# Altium schematic sheet BPF.SchDoc: BPF
size A2 portrait; DocumentNumber: 13; Revision: 2.0; SheetNumber: 13; SheetTotal: 18; DocumentName: Лист 1.SCHDOC
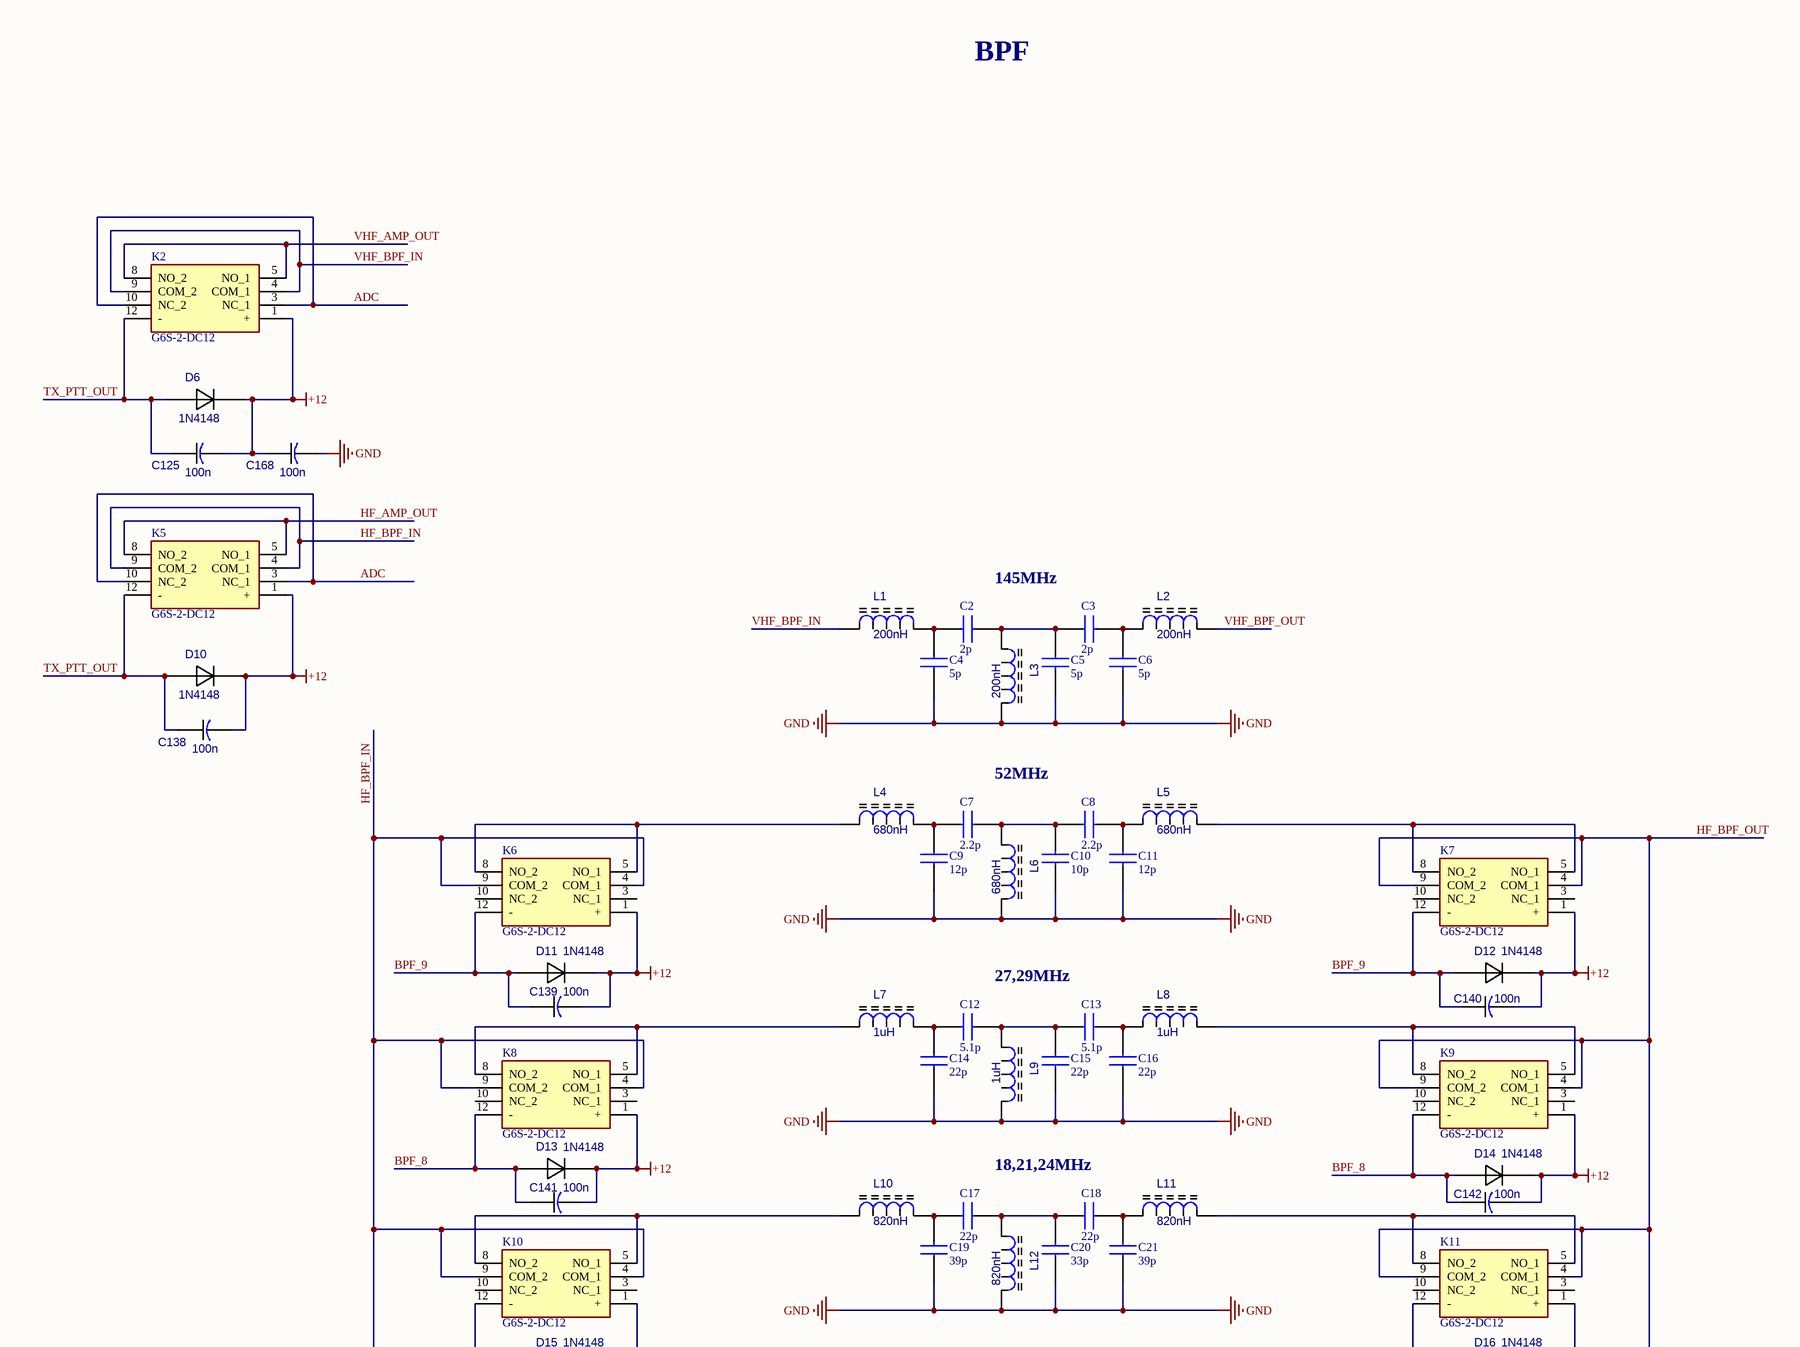
[diagram p0: BPF.SchDoc, top]
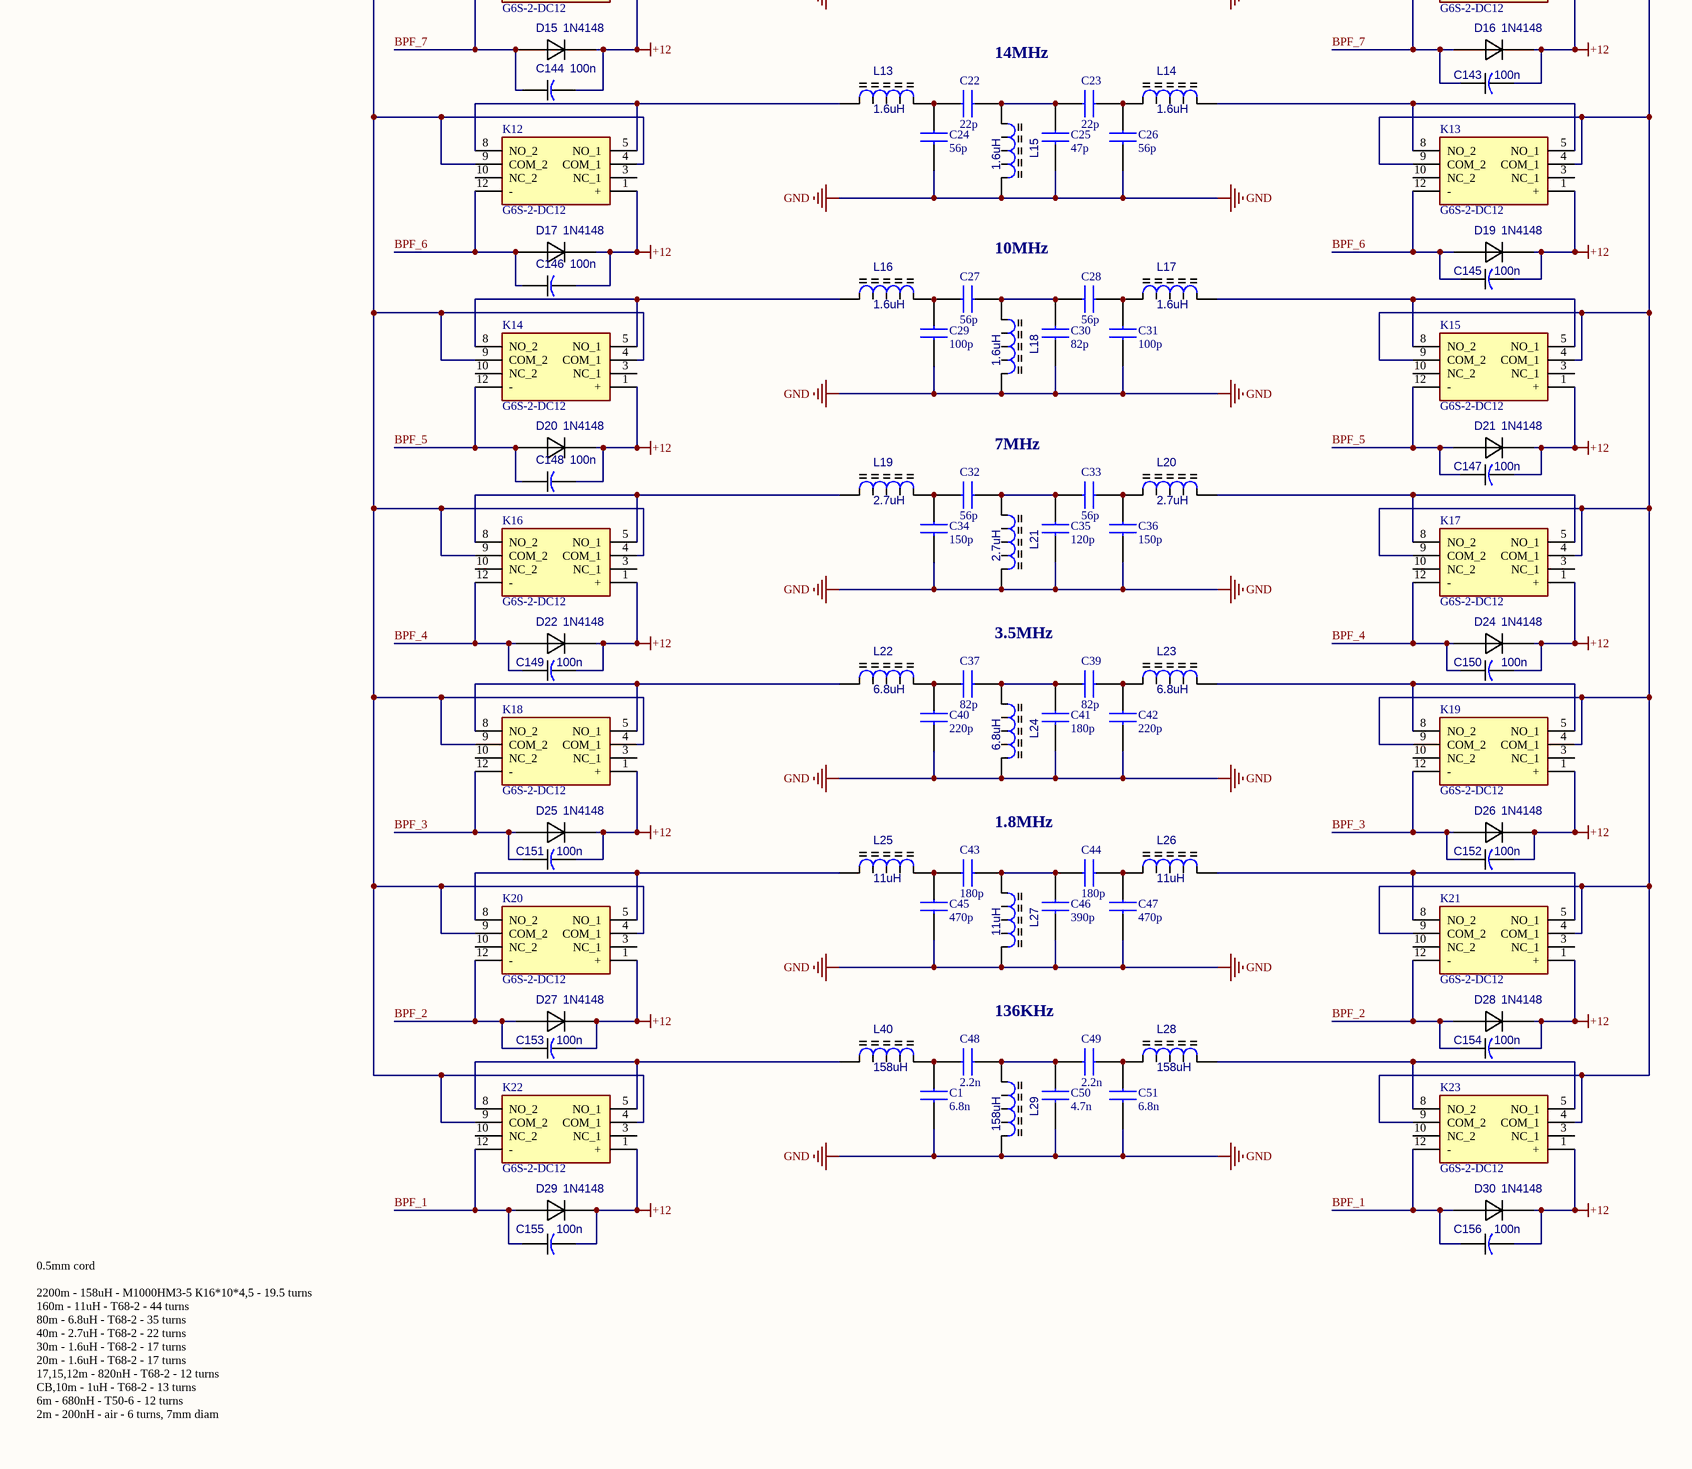
[diagram p1: BPF.SchDoc, bottom]

## Parts
C1  6.8n  [CAP_1206]
C2  2p  [CAP_1206]
C3  2p  [CAP_1206]
C4  5p  [CAP_1206]
C5  5p  [CAP_1206]
C6  5p  [CAP_1206]
C7  2.2p  [CAP_1206]
C8  2.2p  [CAP_1206]
C9  12p  [CAP_1206]
C10  10p  [CAP_1206]
C11  12p  [CAP_1206]
C12  5.1p  [CAP_1206]
C13  5.1p  [CAP_1206]
C14  22p  [CAP_1206]
C15  22p  [CAP_1206]
C16  22p  [CAP_1206]
C17  22p  [CAP_1206]
C18  22p  [CAP_1206]
C19  39p  [CAP_1206]
C20  33p  [CAP_1206]
C21  39p  [CAP_1206]
C22  22p  [CAP_1206]
C23  22p  [CAP_1206]
C24  56p  [CAP_1206]
C25  47p  [CAP_1206]
C26  56p  [CAP_1206]
C27  56p  [CAP_1206]
C28  56p  [CAP_1206]
C29  100p  [CAP_1206]
C30  82p  [CAP_1206]
C31  100p  [CAP_1206]
C32  56p  [CAP_1206]
C33  56p  [CAP_1206]
C34  150p  [CAP_1206]
C35  120p  [CAP_1206]
C36  150p  [CAP_1206]
C37  82p  [CAP_1206]
C39  82p  [CAP_1206]
C40  220p  [CAP_1206]
C41  180p  [CAP_1206]
C42  220p  [CAP_1206]
C43  180p  [CAP_1206]
C44  180p  [CAP_1206]
C45  470p  [CAP_1206]
C46  390p  [CAP_1206]
C47  470p  [CAP_1206]
C48  2.2n  [CAP_1206]
C49  2.2n  [CAP_1206]
C50  4.7n  [CAP_1206]
C51  6.8n  [CAP_1206]
C125  100n  [CAP_0805]
C138  100n  [CAP_0805]
C139  100n  [CAP_0805]
C140  100n  [CAP_0805]
C141  100n  [CAP_0805]
C142  100n  [CAP_0805]
C143  100n  [CAP_0805]
C144  100n  [CAP_0805]
C145  100n  [CAP_0805]
C146  100n  [CAP_0805]
C147  100n  [CAP_0805]
C148  100n  [CAP_0805]
C149  100n  [CAP_0805]
C150  100n  [CAP_0805]
C151  100n  [CAP_0805]
C152  100n  [CAP_0805]
C153  100n  [CAP_0805]
C154  100n  [CAP_0805]
C155  100n  [CAP_0805]
C156  100n  [CAP_0805]
C168  100n  [CAP_0805]
D6  1N4148  [SS14]
D10  1N4148  [SS14]
D11  1N4148  [SS14]
D12  1N4148  [SS14]
D13  1N4148  [SS14]
D14  1N4148  [SS14]
D15  1N4148  [SS14]
D16  1N4148  [SS14]
D17  1N4148  [SS14]
D19  1N4148  [SS14]
D20  1N4148  [SS14]
D21  1N4148  [SS14]
D22  1N4148  [SS14]
D24  1N4148  [SS14]
D25  1N4148  [SS14]
D26  1N4148  [SS14]
D27  1N4148  [SS14]
D28  1N4148  [SS14]
D29  1N4148  [SS14]
D30  1N4148  [SS14]
K2  G6S-2-DC12  [G6S2DC12]
K5  G6S-2-DC12  [G6S2DC12]
K6  G6S-2-DC12  [G6S2DC12]
K7  G6S-2-DC12  [G6S2DC12]
K8  G6S-2-DC12  [G6S2DC12]
K9  G6S-2-DC12  [G6S2DC12]
K10  G6S-2-DC12  [G6S2DC12]
K11  G6S-2-DC12  [G6S2DC12]
K12  G6S-2-DC12  [G6S2DC12]
K13  G6S-2-DC12  [G6S2DC12]
K14  G6S-2-DC12  [G6S2DC12]
K15  G6S-2-DC12  [G6S2DC12]
K16  G6S-2-DC12  [G6S2DC12]
K17  G6S-2-DC12  [G6S2DC12]
K18  G6S-2-DC12  [G6S2DC12]
K19  G6S-2-DC12  [G6S2DC12]
K20  G6S-2-DC12  [G6S2DC12]
K21  G6S-2-DC12  [G6S2DC12]
K22  G6S-2-DC12  [G6S2DC12]
K23  G6S-2-DC12  [G6S2DC12]
L1  200nH  [IND_FERRITE_CORE_1]
L2  200nH  [IND_FERRITE_CORE_1]
L3  200nH  [IND_FERRITE_CORE_1]
L4  680nH  [IND_FERRITE_CORE_1]
L5  680nH  [IND_FERRITE_CORE_1]
L6  680nH  [IND_FERRITE_CORE_1]
L7  1uH  [IND_FERRITE_CORE_1]
L8  1uH  [IND_FERRITE_CORE_1]
L9  1uH  [IND_FERRITE_CORE_1]
L10  820nH  [IND_FERRITE_CORE_1]
L11  820nH  [IND_FERRITE_CORE_1]
L12  820nH  [IND_FERRITE_CORE_1]
L13  1.6uH  [IND_FERRITE_CORE_1]
L14  1.6uH  [IND_FERRITE_CORE_1]
L15  1.6uH  [IND_FERRITE_CORE_1]
L16  1.6uH  [IND_FERRITE_CORE_1]
L17  1.6uH  [IND_FERRITE_CORE_1]
L18  1.6uH  [IND_FERRITE_CORE_1]
L19  2.7uH  [IND_FERRITE_CORE_1]
L20  2.7uH  [IND_FERRITE_CORE_1]
L21  2.7uH  [IND_FERRITE_CORE_1]
L22  6.8uH  [IND_FERRITE_CORE_1]
L23  6.8uH  [IND_FERRITE_CORE_1]
L24  6.8uH  [IND_FERRITE_CORE_1]
L25  11uH  [IND_FERRITE_CORE_1]
L26  11uH  [IND_FERRITE_CORE_1]
L27  11uH  [IND_FERRITE_CORE_1]
L28  158uH  [IND_FERRITE_CORE_1]
L29  158uH  [IND_FERRITE_CORE_1]
L40  158uH  [IND_FERRITE_CORE_1]

## Nets
+12: C125.2 C138.2 C139.2 C140.2 C141.2 C142.2 C143.2 C144.2 C145.2 C146.2 C147.2 C148.2 C149.2 C150.2 C151.2 C152.2 C153.2 C154.2 C155.2 C156.2 C168.1 D6.1(K) D10.1(K) D11.1(K) D12.1(K) D13.1(K) D14.1(K) D15.1(K) D16.1(K) D17.1(K) D19.1(K) D20.1(K) D21.1(K) D22.1(K) D24.1(K) D25.1(K) D26.1(K) D27.1(K) D28.1(K) D29.1(K) D30.1(K) K2.1(+) K5.1(+) K6.1(+) K7.1(+) K8.1(+) K9.1(+) K10.1(+) K11.1(+) K12.1(+) K13.1(+) K14.1(+) K15.1(+) K16.1(+) K17.1(+) K18.1(+) K19.1(+) K20.1(+) K21.1(+) K22.1(+) K23.1(+)
GND: C1.1 C4.1 C5.1 C6.1 C9.1 C10.1 C11.1 C14.1 C15.1 C16.1 C19.1 C20.1 C21.1 C24.1 C25.1 C26.1 C29.1 C30.1 C31.1 C34.1 C35.1 C36.1 C40.1 C41.1 C42.1 C45.1 C46.1 C47.1 C50.1 C51.1 C168.2 L3.2(B) L6.2(B) L9.2(B) L12.2(B) L15.2(B) L18.2(B) L21.2(B) L24.2(B) L27.2(B) L29.2(B)
ADC: K2.3(NC_1) K2.10(NC_2) K5.3(NC_1) K5.10(NC_2)
BPF_1: C155.1 C156.1 D29.2(A) D30.2(A) K22.12(-) K23.12(-)
BPF_2: C153.1 C154.1 D27.2(A) D28.2(A) K20.12(-) K21.12(-)
BPF_3: C151.1 C152.1 D25.2(A) D26.2(A) K18.12(-) K19.12(-)
BPF_4: C149.1 C150.1 D22.2(A) D24.2(A) K16.12(-) K17.12(-)
BPF_5: C147.1 C148.1 D20.2(A) D21.2(A) K14.12(-) K15.12(-)
BPF_6: C145.1 C146.1 D17.2(A) D19.2(A) K12.12(-) K13.12(-)
BPF_7: C143.1 C144.1 D15.2(A) D16.2(A) K10.12(-) K11.12(-)
BPF_8: C141.1 C142.1 D13.2(A) D14.2(A) K8.12(-) K9.12(-)
BPF_9: C139.1 C140.1 D11.2(A) D12.2(A) K6.12(-) K7.12(-)
HF_AMP_OUT: K5.5(NO_1) K5.8(NO_2)
HF_BPF_IN: K5.4(COM_1) K5.9(COM_2) K6.4(COM_1) K6.9(COM_2) K8.4(COM_1) K8.9(COM_2) K10.4(COM_1) K10.9(COM_2) K12.4(COM_1) K12.9(COM_2) K14.4(COM_1) K14.9(COM_2) K16.4(COM_1) K16.9(COM_2) K18.4(COM_1) K18.9(COM_2) K20.4(COM_1) K20.9(COM_2) K22.4(COM_1) K22.9(COM_2)
HF_BPF_OUT: K7.4(COM_1) K7.9(COM_2) K9.4(COM_1) K9.9(COM_2) K11.4(COM_1) K11.9(COM_2) K13.4(COM_1) K13.9(COM_2) K15.4(COM_1) K15.9(COM_2) K17.4(COM_1) K17.9(COM_2) K19.4(COM_1) K19.9(COM_2) K21.4(COM_1) K21.9(COM_2) K23.4(COM_1) K23.9(COM_2)
TX_PTT_OUT: C125.1 C138.1 D6.2(A) D10.2(A) K2.12(-) K5.12(-)
VHF_AMP_OUT: K2.5(NO_1) K2.8(NO_2)
VHF_BPF_IN: K2.4(COM_1) K2.9(COM_2) L1.1(A)
VHF_BPF_OUT: L2.2(B)
NetC1_2: C1.2 C48.2 L40.2(B)
NetC2_1: C2.1 C3.2 C5.2 L3.1(A)
NetC2_2: C2.2 C4.2 L1.2(B)
NetC3_1: C3.1 C6.2 L2.1(A)
NetC7_1: C7.1 C8.2 C10.2 L6.1(A)
NetC7_2: C7.2 C9.2 L4.2(B)
NetC8_1: C8.1 C11.2 L5.1(A)
NetC12_1: C12.1 C13.2 C15.2 L9.1(A)
NetC12_2: C12.2 C14.2 L7.2(B)
NetC13_1: C13.1 C16.2 L8.1(A)
NetC17_1: C17.1 C18.2 C20.2 L12.1(A)
NetC17_2: C17.2 C19.2 L10.2(B)
NetC18_1: C18.1 C21.2 L11.1(A)
NetC22_1: C22.1 C23.2 C25.2 L15.1(A)
NetC22_2: C22.2 C24.2 L13.2(B)
NetC23_1: C23.1 C26.2 L14.1(A)
NetC27_1: C27.1 C28.2 C30.2 L18.1(A)
NetC27_2: C27.2 C29.2 L16.2(B)
NetC28_1: C28.1 C31.2 L17.1(A)
NetC32_1: C32.1 C33.2 C35.2 L21.1(A)
NetC32_2: C32.2 C34.2 L19.2(B)
NetC33_1: C33.1 C36.2 L20.1(A)
NetC37_1: C37.1 C39.2 C41.2 L24.1(A)
NetC37_2: C37.2 C40.2 L22.2(B)
NetC39_1: C39.1 C42.2 L23.1(A)
NetC43_1: C43.1 C44.2 C46.2 L27.1(A)
NetC43_2: C43.2 C45.2 L25.2(B)
NetC44_1: C44.1 C47.2 L26.1(A)
NetC48_1: C48.1 C49.2 C50.2 L29.1(A)
NetC49_1: C49.1 C51.2 L28.1(A)
NetK6_5: K6.5(NO_1) K6.8(NO_2) L4.1(A)
NetK7_5: K7.5(NO_1) K7.8(NO_2) L5.2(B)
NetK8_5: K8.5(NO_1) K8.8(NO_2) L7.1(A)
NetK9_5: K9.5(NO_1) K9.8(NO_2) L8.2(B)
NetK10_5: K10.5(NO_1) K10.8(NO_2) L10.1(A)
NetK11_5: K11.5(NO_1) K11.8(NO_2) L11.2(B)
NetK12_5: K12.5(NO_1) K12.8(NO_2) L13.1(A)
NetK13_5: K13.5(NO_1) K13.8(NO_2) L14.2(B)
NetK14_5: K14.5(NO_1) K14.8(NO_2) L16.1(A)
NetK15_5: K15.5(NO_1) K15.8(NO_2) L17.2(B)
NetK16_5: K16.5(NO_1) K16.8(NO_2) L19.1(A)
NetK17_5: K17.5(NO_1) K17.8(NO_2) L20.2(B)
NetK18_5: K18.5(NO_1) K18.8(NO_2) L22.1(A)
NetK19_5: K19.5(NO_1) K19.8(NO_2) L23.2(B)
NetK20_5: K20.5(NO_1) K20.8(NO_2) L25.1(A)
NetK21_5: K21.5(NO_1) K21.8(NO_2) L26.2(B)
NetK22_5: K22.5(NO_1) K22.8(NO_2) L40.1(A)
NetK23_5: K23.5(NO_1) K23.8(NO_2) L28.2(B)

Not connected (* = marked no-connect by the designer): K6 3(NC_1) 10(NC_2); K7 3(NC_1) 10(NC_2); K8 3(NC_1) 10(NC_2); K9 3(NC_1) 10(NC_2); K10 3(NC_1) 10(NC_2); K11 3(NC_1) 10(NC_2); K12 3(NC_1) 10(NC_2); K13 3(NC_1) 10(NC_2); K14 3(NC_1) 10(NC_2); K15 3(NC_1) 10(NC_2); K16 3(NC_1) 10(NC_2); K17 3(NC_1) 10(NC_2); K18 3(NC_1) 10(NC_2); K19 3(NC_1) 10(NC_2); K20 3(NC_1) 10(NC_2); K21 3(NC_1) 10(NC_2); K22 3(NC_1) 10(NC_2); K23 3(NC_1) 10(NC_2)

## Notes on the sheet
- BPF
- 145MHz
- 52MHz
- 27,29MHz
- 18,21,24MHz
- 14MHz
- 10MHz
- 7MHz
- 3.5MHz
- 1.8MHz
- 136KHz
- 0.5mm cord
  2200m - 158uH - М1000НМ3-5 К16*10*4,5 - 19.5 turns
  160m - 11uH - T68-2 - 44 turns
  80m - 6.8uH - T68-2 - 35 turns
  40m - 2.7uH - T68-2 - 22 turns
  30m - 1.6uH - T68-2 - 17 turns
  20m - 1.6uH - T68-2 - 17 turns
  17,15,12m - 820nH - T68-2 - 12 turns
  CB,10m - 1uH - T68-2 - 13 turns
  6m - 680nH - T50-6 - 12 turns
  2m - 200nH - air - 6 turns, 7mm diam
- Title
- Size:
- Date:
- File:
- A2
- Number:
- Time:
- Revision:
- Sheet
- of

## Library data of the parts
C1-C37 C39-C51 = B32620A0682J000: Capacitor NP0 HiVolt; Manufacturer_Name: TDK; Datasheet Link: https://www.tdk-electronics.tdk.com/inf/20/20/db/fc_2009/MKP_B32620_621.pdf; Height: 12mm; Manufacturer_Part_Number: B32620A0682J000; Mouser Part Number: 871-B32620A682J; Mouser Price/Stock: https://www.mouser.com/Search/Refine.aspx?Keyword=871-B32620A682J
C125 C138-C156 C168 = CAP_0805
K2 K5-K23 = G6S-2-DC12: Relay or Contactor; Manufacturer_Name: Omron Electronics; Datasheet Link: https://componentsearchengine.com/Datasheets/1/G6S-2-DC12.pdf; Height: 9.4mm; Manufacturer_Part_Number: G6S-2-DC12; Mouser Part Number: 653-G6S-2-DC12A; Mouser Price/Stock: https://www.mouser.co.uk/ProductDetail/Omron-Electronics/G6S-2-DC12/?qs=QGk6feVlqMLN9Ouv0QsFzA%3D%3D
L1-L29 L40 = IND_FERRITE_CORE: Inductor
D6 D10-D17 D19-D22 D24-D30 = 1N4148: Value: *